# Altium project Minion_1_SiC780A_Rev01.PrjPCB (part 3 of 3)
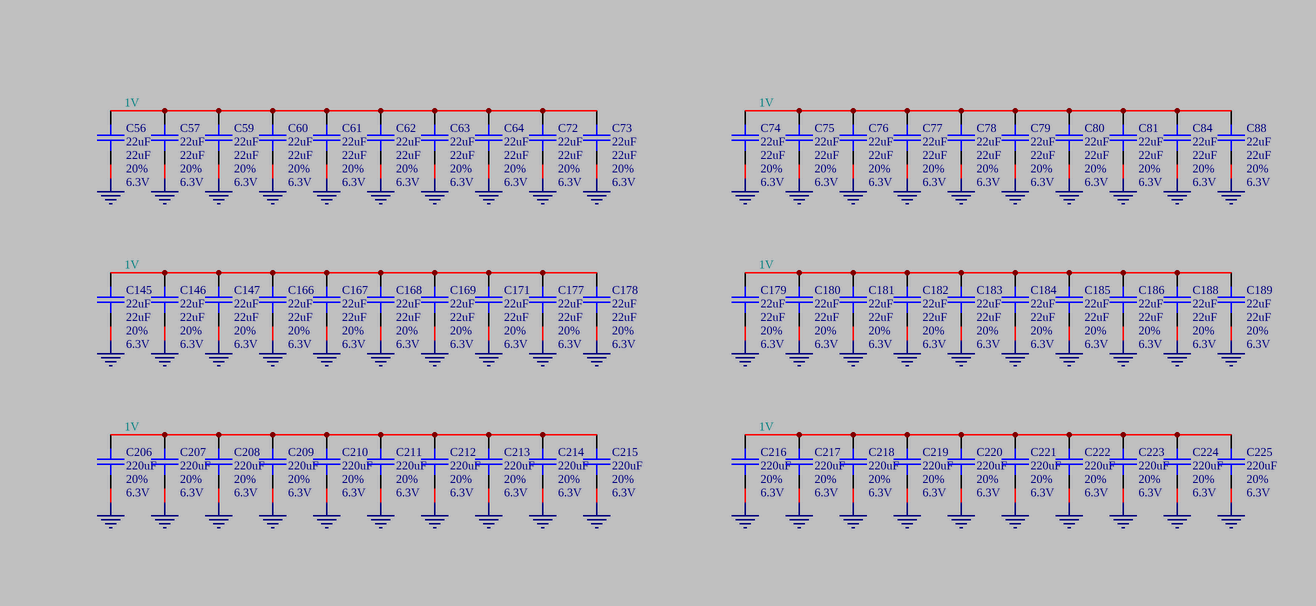
[diagram p12: VDD_GND.SchDoc, bottom right]

## Assembly variants
220uF: not fitted C4 C18 C19 C20 C21 C23 C24 C25 C27 C28 C29 C31 C33 C34 C35 C36 C37 C38 C39 C40 C44 C45 C46 C48 C49 C50 C51 C52 C53 C55 C56 C57 C59 C60 C61 C62 C63 C64 C65 C66 C67 C68 C69 C70 C71 C72 C73 C74 C75 C76 C77 C78 C79 C80 C81 C82 C83 C84 C86 C87 C88 C90 C91 C94 C95 C97 C98 C100 C103 C104 C105 C106 C107 C108 C109 C110 C111 C112 C113 C114 C115 C116 C118 C119 C120 C122 C123 C124 C126 C127 C128 C129 C130 C131 C135 C136 C137 C138 C139 C141 C142 C143 C144 C145 C146 C147 C148 C149 C150 C151 C152 C153 C154 C155 C166 C167 C168 C169 C170 C171 C172 C173 C175 C176 C177 C178 C179 C180 C181 C182 C183 C184 C185 C186 C187 C188 C189 C197 C199 C200 C202 C203 C205 C263 C264 C265 C266 C268 C269 C271 C272 C274 C275 C331 C332 C333 C334 C378 C379 C380 C598 C600 C603 C606 C640 C642 C652 C654 C655 C657 C658 C660 C711 C814 D12 D13 D16 R16 R17 TP1 TP2 TP3 TP4 TP5 TP6 TP7 TP8 TP9 TP10 TP11 TP12 TP13 TP14 TP15 TP16 TP17 TP18 TP19 TP20 TP21 TP22 TP23 TP25 TP26 TP27 TP28 TP29 TP30 TP31 TP32 TP123 TP124 TP125 TP126 TP127 TP128 TP129 TP131 TP132 YO4 YO6 YO7
22uF: not fitted C32 C41 C42 C43 C47 C92 C96 C99 C101 C102 C132 C133 C134 C140 C156 C157 C158 C159 C160 C161 C162 C163 C164 C165 C174 C190 C191 C192 C193 C194 C195 C196 C198 C201 C204 C206 C207 C208 C209 C210 C211 C212 C213 C214 C215 C216 C217 C218 C219 C220 C221 C222 C223 C224 C225 C258 C259 C260 C261 C262 C267 C270 C273 C276 C373 C374 C375 C376 C377 C381 C382 C397 C398 C399 C400 C401 C404 C405 C406 C407 C596 C599 C602 C605 C653 C656 C659 D12 D13 D16 R16 R17 TP1 TP2 TP3 TP4 TP5 TP6 TP7 TP8 TP9 TP10 TP11 TP12 TP13 TP14 TP15 TP16 TP17 TP18 TP19 TP20 TP21 TP22 TP23 TP25 TP26 TP27 TP28 TP29 TP30 TP31 TP32 TP123 TP124 TP125 TP126 TP127 TP128 TP129 TP131 TP132 YO4 YO6 YO7